# Altium project PCB_tutorial.PrjPcb
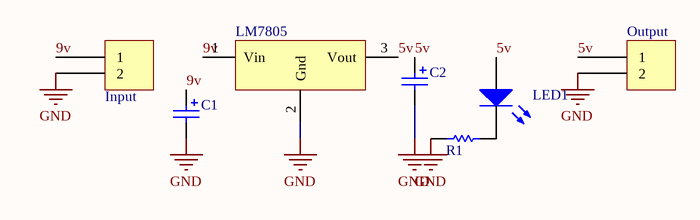
[diagram p0: PCB_tutorial.SchDoc]
1 sheet, 7 parts. Net scope: global (net labels, ports and power ports of the same name join across sheets).
Board file: PCB_tutorial.PcbDoc

## Sheet PCB_tutorial.SchDoc
size A4; SheetNumber: 1; SheetTotal: 1

### Parts
C1  Cap Polar 100uF  [Cap 100uF]  (value not drawn)
C2  Cap Polar 100uF  [Cap 100uF]  (value not drawn)
Input  Terminal Barrier Besar 2 PIN  [Terminal Barrier Besar 2 PIN]  (value not drawn)
LED1  LED 5mm  [LED 5mm]  (value not drawn)
LM7805  78XX/79XX - with Heatsink  [78XX/79XX HEATSINK]  (value not drawn)
Output  Terminal Barrier Besar 2 PIN  [Terminal Barrier Besar 2 PIN]  (value not drawn)
R1  Resistor 0.25W  [Resistor 0.25W]  (value not drawn)

### Nets
GND: C1.2 C2.2 Input.2 LM7805.2(Gnd) Output.2 R1.2
5v: C2.1 LED1.1(A) LM7805.3(Vout) Output.1
9v: C1.1 Input.1 LM7805.1(Vin)
NetLED1_2: LED1.2(K) R1.1

### Library data of the parts
C1 C2 = Cap 100uF
Input Output = Terminal Barrier Besar 2 PIN: Tanpa Kuping
LM7805 = 78XX/79XX-heatsink